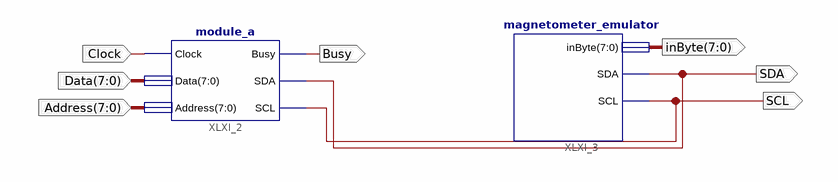
[diagram p0: schematic sheet 1]
// Xilinx ISE schematic driver_and_emulator.sch (spartan3e) as structural Verilog: 2 symbols, 7 ports
module driver_and_emulator (
  input  Clock,
  input  [7:0] Data,
  input  [7:0] Address,
  output SDA,
  output SCL,
  output Busy,
  output [7:0] inByte
);

  module_a XLXI_2 (.Clock(Clock), .Data(Data), .Address(Address), .SDA(SDA), .SCL(SCL), .Busy(Busy));
  magnetometer_emulator XLXI_3 (.SDA(SDA), .SCL(SCL), .inByte(inByte));
endmodule
